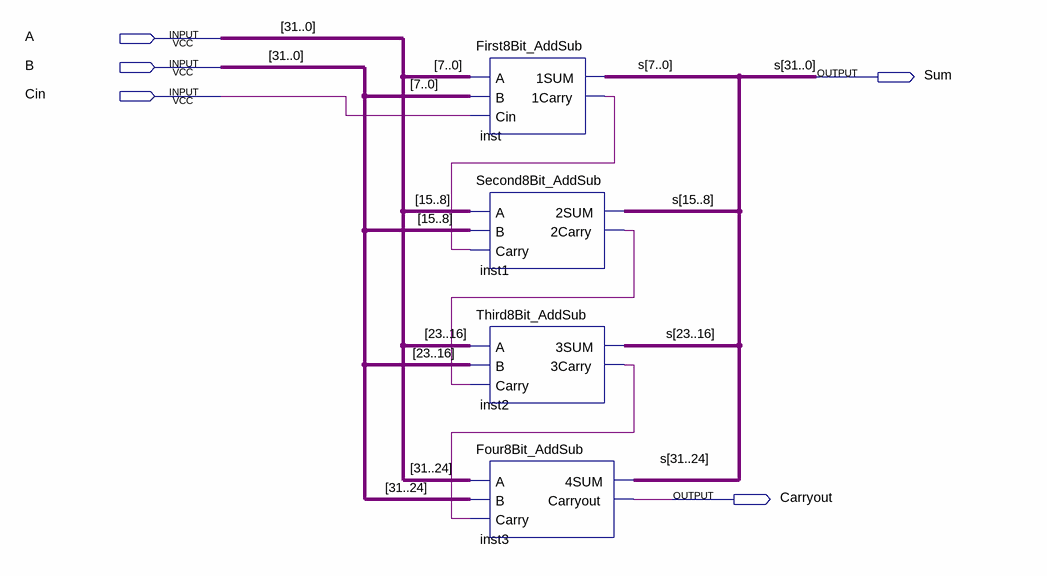
[diagram p0: schematic sheet]
// Quartus schematic 32Bit_Addsub.bdf as structural Verilog: 4 symbols, 5 pins
module \32Bit_Addsub  (
  input  A,
  input  B,
  input  Cin,
  output Sum,
  output Carryout
);

  wire inst1_2carry, inst2_3carry, inst_1carry;
  wire [31:0] s;

  First8Bit_AddSub inst (.A(A), .B(B), .Cin(Cin), .\1SUM (s[7:0]), .\1Carry (inst_1carry));
  Second8Bit_AddSub inst1 (.A(A), .B(B), .Carry(inst_1carry), .\2SUM (s[15:8]), .\2Carry (inst1_2carry));
  Third8Bit_AddSub inst2 (.A(A), .B(B), .Carry(inst1_2carry), .\3SUM (s[23:16]), .\3Carry (inst2_3carry));
  Four8Bit_AddSub inst3 (.A(A), .B(B), .Carry(inst2_3carry), .\4SUM (s[31:24]), .Carryout(Carryout));
endmodule
